# Altium schematic sheet AnalogConditioning.SchDoc: Analog Signal Conditioning
size Letter; Engineer: Nathan Petersen; DocumentNumber: 8; Revision: v1.2; SheetNumber: 8; SheetTotal: 23
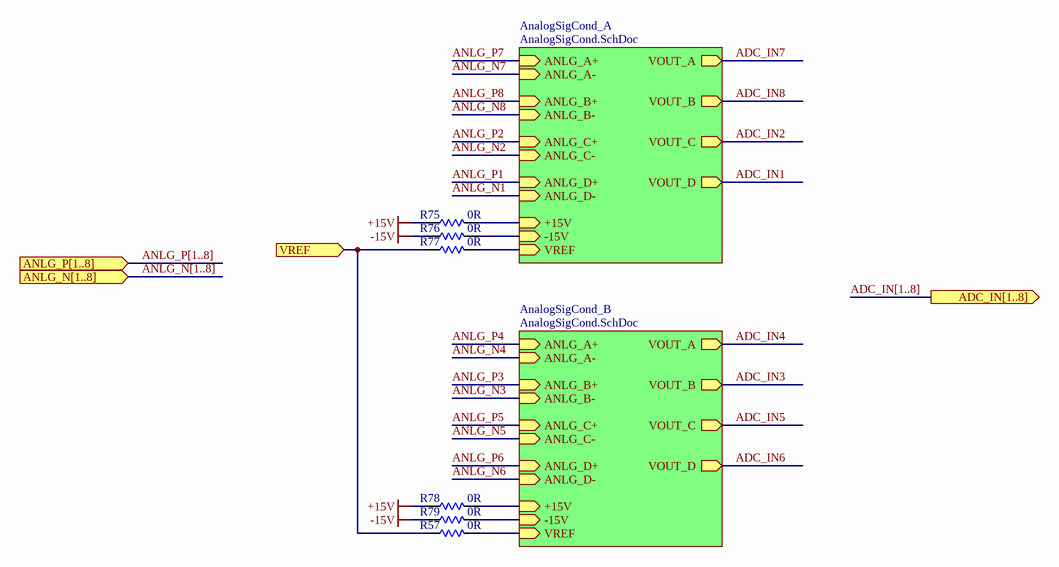
[diagram p0: AnalogConditioning.SchDoc]

## Parts
R57  value 0R  [1206-RES]  (hidden comment: Resistor)
R75  value 0R  [1206-RES]  (hidden comment: Resistor)
R76  value 0R  [1206-RES]  (hidden comment: Resistor)
R77  value 0R  [1206-RES]  (hidden comment: Resistor)
R78  value 0R  [1206-RES]  (hidden comment: Resistor)
R79  value 0R  [1206-RES]  (hidden comment: Resistor)

## Sub-sheets
AnalogSigCond_A = AnalogSigCond.SchDoc: +15V (in), -15V (in), VREF (in), ANLG_A+ (in), ANLG_A- (in), ANLG_B+ (in), ANLG_B- (in), ANLG_C+ (in), ANLG_C- (in), ANLG_D+ (in), ANLG_D- (in), VOUT_A (out), VOUT_B (out), VOUT_C (out), VOUT_D (out)
AnalogSigCond_B = AnalogSigCond.SchDoc: +15V (in), -15V (in), VREF (in), ANLG_A+ (in), ANLG_A- (in), ANLG_B+ (in), ANLG_B- (in), ANLG_C+ (in), ANLG_C- (in), ANLG_D+ (in), ANLG_D- (in), VOUT_A (out), VOUT_B (out), VOUT_C (out), VOUT_D (out)

## Ports
ADC_IN[1..8] (out), ANLG_N[1..8] (in), ANLG_P[1..8] (in), VREF (in)

## Nets
+15V: R75.1 R78.1
-15V: R76.1 R79.1
ADC_IN1: sheet AnalogSigCond_A/VOUT_D
ADC_IN2: sheet AnalogSigCond_A/VOUT_C
ADC_IN3: sheet AnalogSigCond_B/VOUT_B
ADC_IN4: sheet AnalogSigCond_B/VOUT_A
ADC_IN5: sheet AnalogSigCond_B/VOUT_C
ADC_IN6: sheet AnalogSigCond_B/VOUT_D
ADC_IN7: sheet AnalogSigCond_A/VOUT_A
ADC_IN8: sheet AnalogSigCond_A/VOUT_B
ANLG_N1: sheet AnalogSigCond_A/ANLG_D-
ANLG_N2: sheet AnalogSigCond_A/ANLG_C-
ANLG_N3: sheet AnalogSigCond_B/ANLG_B-
ANLG_N4: sheet AnalogSigCond_B/ANLG_A-
ANLG_N5: sheet AnalogSigCond_B/ANLG_C-
ANLG_N6: sheet AnalogSigCond_B/ANLG_D-
ANLG_N7: sheet AnalogSigCond_A/ANLG_A-
ANLG_N8: sheet AnalogSigCond_A/ANLG_B-
ANLG_P1: sheet AnalogSigCond_A/ANLG_D+
ANLG_P2: sheet AnalogSigCond_A/ANLG_C+
ANLG_P3: sheet AnalogSigCond_B/ANLG_B+
ANLG_P4: sheet AnalogSigCond_B/ANLG_A+
ANLG_P5: sheet AnalogSigCond_B/ANLG_C+
ANLG_P6: sheet AnalogSigCond_B/ANLG_D+
ANLG_P7: sheet AnalogSigCond_A/ANLG_A+
ANLG_P8: sheet AnalogSigCond_A/ANLG_B+
VREF: R57.1 R77.1 ; port VREF
NetR57_2: R57.2 ; sheet AnalogSigCond_B/VREF
NetR75_2: R75.2 ; sheet AnalogSigCond_A/+15V
NetR76_2: R76.2 ; sheet AnalogSigCond_A/-15V
NetR77_2: R77.2 ; sheet AnalogSigCond_A/VREF
NetR78_2: R78.2 ; sheet AnalogSigCond_B/+15V
NetR79_2: R79.2 ; sheet AnalogSigCond_B/-15V

## Buses and harness runs
bus ADC_IN[1..8] = port ADC_IN[1..8]
bus ANLG_N[1..8] = port ANLG_N[1..8]
bus ANLG_P[1..8] = port ANLG_P[1..8]

## Notes on the sheet
- Title:
- File:
- Sheet:
- of
- Revision:
- Time:
- Date:
- Engineer:

## Library data of the parts
R57 R75-R79 = Resistor: Supplier 1: Digi-Key; Supplier Part Number 1: 311-0.0ERCT-ND